# EAGLE design CC2533_PCB_Biphasic (EAGLE 6.4)
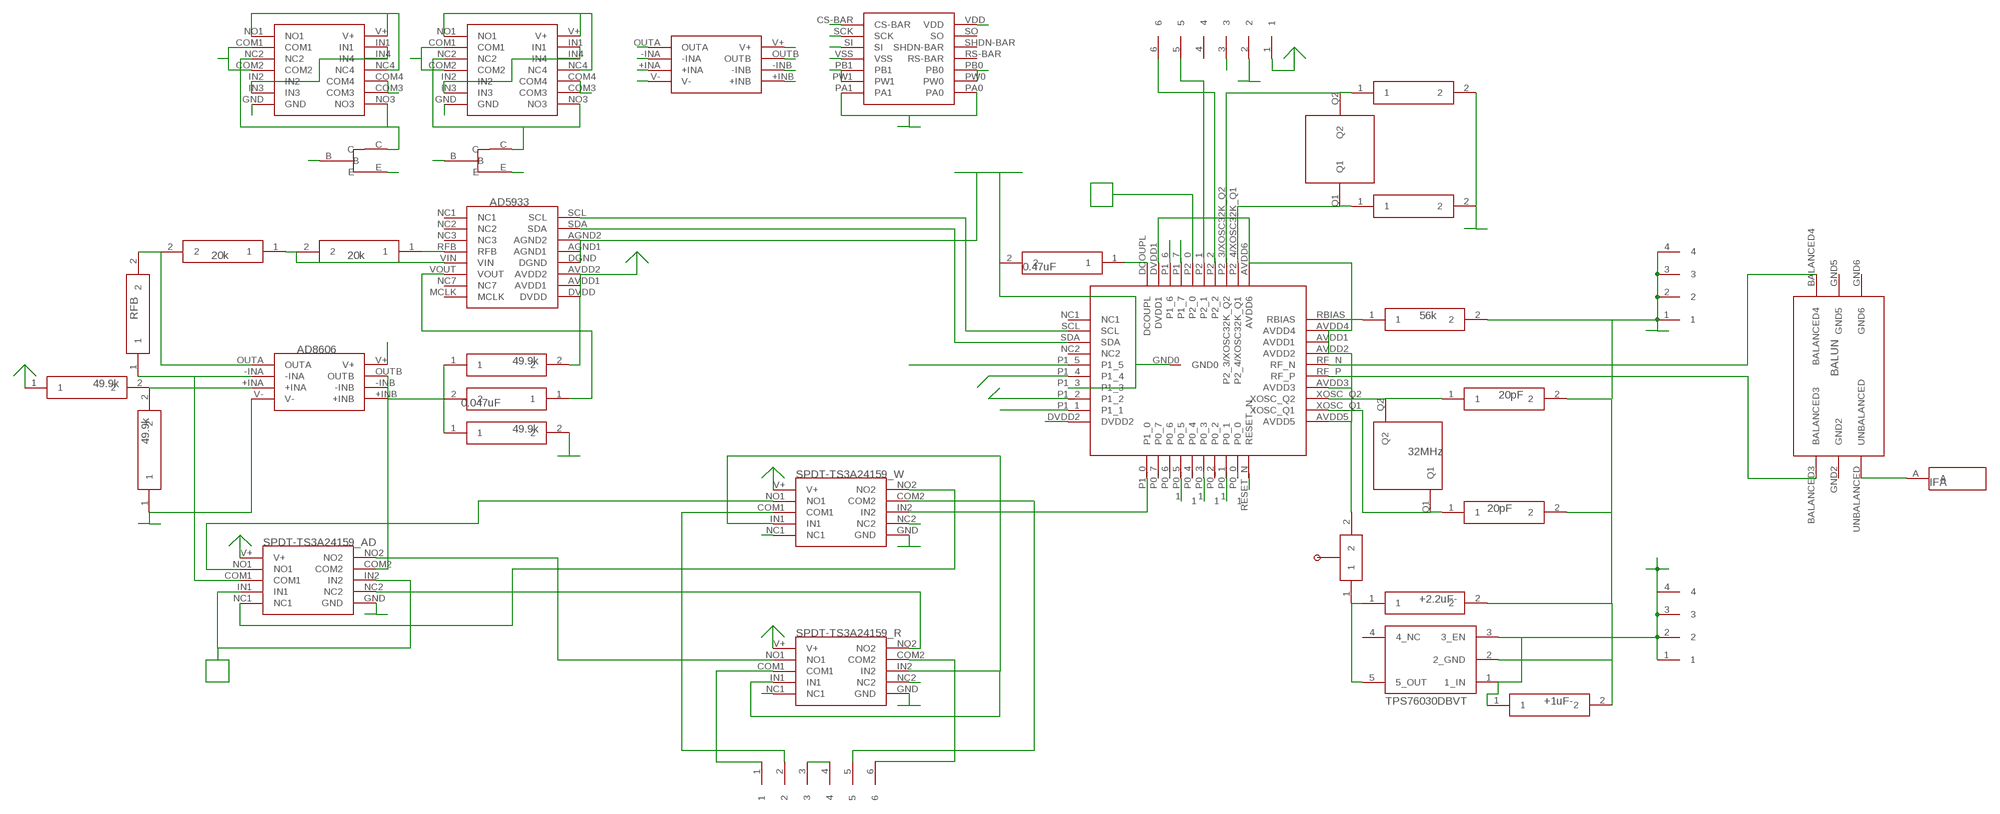
[diagram p0: schematic, sheet 1]

## Parts
U$1  CC2533  [CC2533]
U$2  BALUN  [BALUN]
U$3  X32MHZ  [X32MHZ]
U$4  0201  [0201]
U$5  0201  [0201]
U$6  ANTENNA_BOTTOM  [ANTENNA_BOTTOM]
U$7  FFC4POS  [FFC4POS]
U$8  FFC4POS  [FFC4POS]
U$9  56k  0201  [0201]
U$10  REGULATOR  [REGULATOR]
U$11  0603  [0603]
U$12  0603  [0603]
U$13  SPDT_DUAL  [SPDT_DUAL]
U$14  0201  [0201]
U$15  SPDT_DUAL  [SPDT_DUAL]
U$16  AD5933  [AD5933]
U$17  FFC6POS  [FFC6POS]
U$18  SWITCH_MANUAL  [SWITCH_MANUAL]
U$19  SPDT_DUAL  [SPDT_DUAL]
U$20  AD8606_OPAMP  [AD8606_OPAMP]
U$21  0603_RES  [0603_RES]
U$22  0603_RES  [0603_RES]
U$23  0603_RES  [0603_RES]
U$24  0201  [0201]
U$25  0201  [0201]
U$26  0402_CAP  [0402_CAP]
U$27  0201  [0201]
U$28  0201  [0201]
U$29  DRILL_HOLE  [DRILL_HOLE]
U$30  FFC6POS  [FFC6POS]
U$31  DRILL_HOLE  [DRILL_HOLE]
U$32  AS1753_QUAD_SPST  [AS1753_QUAD_SPST]
U$33  AS1753_QUAD_SPST  [AS1753_QUAD_SPST]
U$34  AD8606_OPAMP  [AD8606_OPAMP]
U$35  MP42100  [MP42100]
U$36  NPN_2SC3707  [NPN_2SC3707]
U$37  NPN_2SC3707  [NPN_2SC3707]
U$38  DRILL_HOLE  [DRILL_HOLE]
U$39  X32.768KHZ  [X32.768KHZ]
U$40  0201  [0201]
U$41  0201  [0201]

## Nets
B1: U$34.OUTA U$36.B
B2: U$34.OUTB U$37.B
C1: U$32.NC2 U$32.NO3 U$36.C
C2: U$33.NC2 U$33.NO3 U$37.C
CLK: U$1.P1_5 U$35.SCK
CS: U$1.P1_1 U$35.CS-BAR
E1: U$34.-INA U$35.PB1 U$35.PW1 U$36.E
E2: U$34.-INB U$35.PB0 U$35.PW0 U$37.E
GND: U$1.GND0 U$1.P1_3 U$4.2 U$5.2 U$8.1 U$8.2 U$8.3 U$8.4 U$9.2 U$10.2(2_GND) U$11.2 U$12.2 U$13.GND U$14.2 U$15.GND U$16.AGND1 U$16.AGND2 U$16.DGND U$17.2 U$19.GND U$20.V- U$25.1 U$28.2 U$30.3 U$30.4 U$32.GND U$33.GND U$34.V- U$35.PA0 U$35.PA1 U$35.VSS U$40.2 U$41.2
I_LEFT: U$15.NC1 U$33.COM1 U$33.COM2
I_LEFT_REF: U$13.NC1 U$33.COM3 U$33.COM4
I_RIGHT: U$15.NC2 U$32.COM1 U$32.COM2
I_RIGHT_REF: U$13.NC2 U$32.COM3 U$32.COM4
IN_5933: U$1.P2_0 U$19.IN1 U$19.IN2
IN_W: U$1.P1_0 U$13.IN1 U$13.IN2 U$15.IN1 U$15.IN2
LEFT: U$1.P1_4 U$34.+INB
MISO: U$1.P1_7 U$32.IN1 U$32.IN2 U$32.IN3 U$32.IN4 U$33.IN1 U$33.IN2 U$33.IN3 U$33.IN4
MOSI: U$1.P1_6 U$35.SI
N$1: U$1.RF_N U$2.BALANCED4
N$2: U$1.RF_P U$2.BALANCED3
N$3: U$2.UNBALANCED U$6.A
N$4: U$1.XOSC_Q2 U$3.Q2 U$5.1
N$5: U$1.XOSC_Q1 U$3.Q1 U$4.1
N$6: U$16.RFB U$21.1
N$7: U$15.NO1 U$19.NO1
N$8: U$15.NO2 U$19.NC1
N$9: U$13.NO1 U$19.NO2
N$10: U$13.NO2 U$19.NC2
N$11: U$19.COM1 U$20.-INA U$23.1
N$12: U$1.RBIAS U$9.1
N$13: U$1.SCL U$16.SCL
N$14: U$1.SDA U$16.SDA
N$15: U$15.COM1 U$30.2
N$16: U$1.P2_4/XOSC32K_Q1 U$39.Q1 U$41.1
N$17: U$1.P2_1 U$17.5
N$18: U$1.DCOUPL U$14.1
N$19: U$16.VOUT U$26.1
N$20: U$1.P2_2 U$17.6
N$21: U$10.5(5_OUT) U$11.1 U$18.1
N$22: U$1.P2_3/XOSC32K_Q2 U$39.Q2 U$40.1
N$23: U$16.VIN U$21.2 U$22.1
N$24: U$1.P0_5 U$29.1
N$25: U$20.OUTA U$22.2 U$23.2
N$27: U$20.+INA U$24.2 U$25.2
N$28: U$20.+INB U$26.2 U$27.1 U$28.1
N$29: U$19.COM2 U$20.-INB U$20.OUTB
N$30: U$15.COM2 U$30.5
N$32: U$13.COM2 U$30.6
N$35: U$13.COM1 U$30.1
P0_1: U$1.P0_1 U$38.1
P0_3: U$1.P0_3 U$31.1
RESET: U$1.RESET_N U$17.3
RIGHT: U$1.P1_2 U$34.+INA
V+: U$7.1 U$7.2 U$7.3 U$7.4 U$10.1(1_IN) U$10.3(3_EN) U$12.1
VDD: U$1.AVDD1 U$1.AVDD2 U$1.AVDD3 U$1.AVDD4 U$1.AVDD5 U$1.AVDD6 U$1.DVDD1 U$1.DVDD2 U$13.V+ U$15.V+ U$16.AVDD1 U$16.AVDD2 U$16.DVDD U$17.1 U$18.2 U$19.V+ U$20.V+ U$24.1 U$27.2 U$32.NC4 U$32.NO1 U$32.V+ U$33.NC4 U$33.NO1 U$33.V+ U$34.V+ U$35.VDD
Unconnected: U$1.P0_0 U$1.P0_2 U$1.P0_4 U$1.P0_6 U$1.P0_7 U$10.4(4_NC) U$16.MCLK U$16.NC1 U$16.NC2 U$16.NC3 U$16.NC7 U$17.4 U$35.RS-BAR U$35.SHDN-BAR U$35.SO

## Power pins joined to a net without a drawn wire
GND2: U$2.GND2
GND5: U$2.GND5
GND6: U$2.GND6
NC1: U$1.NC1
NC2: U$1.NC2

## Library data of the parts
U$1 = CC2530_PCB_TL:CC2533
U$2 = CC2530_PCB_TL:BALUN: 2.45 GHz Impedance Matched Balun-BPF: For TI CC253X, CC254X, CC257X, CC853X and CC852X Chipset family P/N 2450BM15A0002
U$3 = CC2530_PCB_TL:X32MHZ: X32MHz ABM12-32.000MHZ-B2X-T3; X: 32MHz
U$4 U$5 = CC2530_PCB_TL:0201: Package / Case 0201 (0603 Metric); CAP: 20pF
U$6 = CC2530_PCB_TL:ANTENNA_BOTTOM: Antenna for use in bottom layer of CC2530 PCB
U$7 U$8 = CC2530_PCB_TL:FFC4POS: FFC COnnector 4POS
U$9 = CC2530_PCB_TL:0201: Package / Case 0201 (0603 Metric); R_BIAS: 56k
U$10 = CC2530_PCB_TL:REGULATOR: IC REG LDO 3V 50MA SOT23-5 TPS76030DBVT
U$11 = CC2530_PCB_TL:0603: Package / Case 0603 (1608 Metric); CAP: +2.2uF-
U$12 = CC2530_PCB_TL:0603: Package / Case 0603 (1608 Metric); CAP: +1uF-
U$13 U$15 U$19 = CC2530_PCB_TL:SPDT_DUAL: TS3A24159DGSR IC SWITCH DUAL SPDT 10MSOP
U$14 = CC2530_PCB_TL:0201: Package / Case 0201 (0603 Metric); CAP: 0.47uF
U$16 = CC2530_PCB_TL:AD5933: AD5933
U$17 U$30 = CC2530_PCB_TL:FFC6POS: FFC Connector 6POS
U$18 = CC2530_PCB_TL:SWITCH_MANUAL
U$20 U$34 = CC2530_PCB_TL:AD8606_OPAMP: OPAMP AD8606ARMZ-REEL
U$21 U$22 = CC2530_PCB_TL:0603_RES; RES: 20k
U$23 = CC2530_PCB_TL:0603_RES
U$24 U$25 U$27 U$28 = CC2530_PCB_TL:0201: Package / Case 0201 (0603 Metric); RES: 49.9k
U$26 = CC2530_PCB_TL:0402_CAP; CAP: 0.047uF
U$29 U$31 U$38 = CC2530_PCB_TL:DRILL_HOLE
U$32 U$33 = CC2530_PCB_TL:AS1753_QUAD_SPST: QUAD SPST SWITCH AS1753S
U$35 = CC2530_PCB_TL:MP42100: Digital Potentiometer 100K 2CH SPI 14-SOIC MCP42100-I/SL-ND
U$36 U$37 = CC2530_PCB_TL:NPN_2SC3707: NPN Transistor 2SC370700L
U$39 = CC2530_PCB_TL:X32.768KHZ: X32.768kHz 9HT11-32.768KDZC-T
U$40 U$41 = CC2530_PCB_TL:0201: Package / Case 0201 (0603 Metric)

## Board
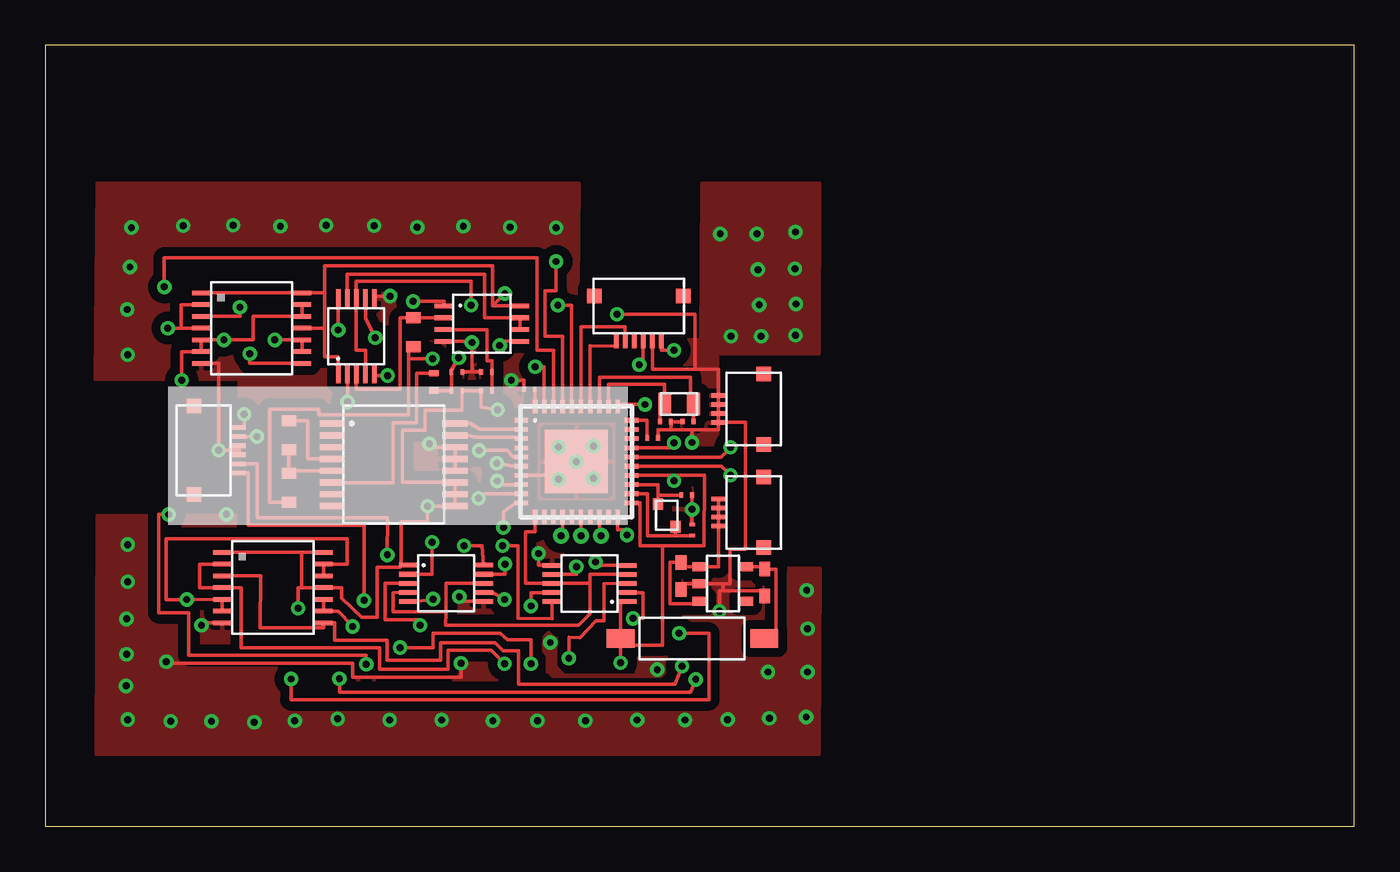
[diagram p1: board, top side]
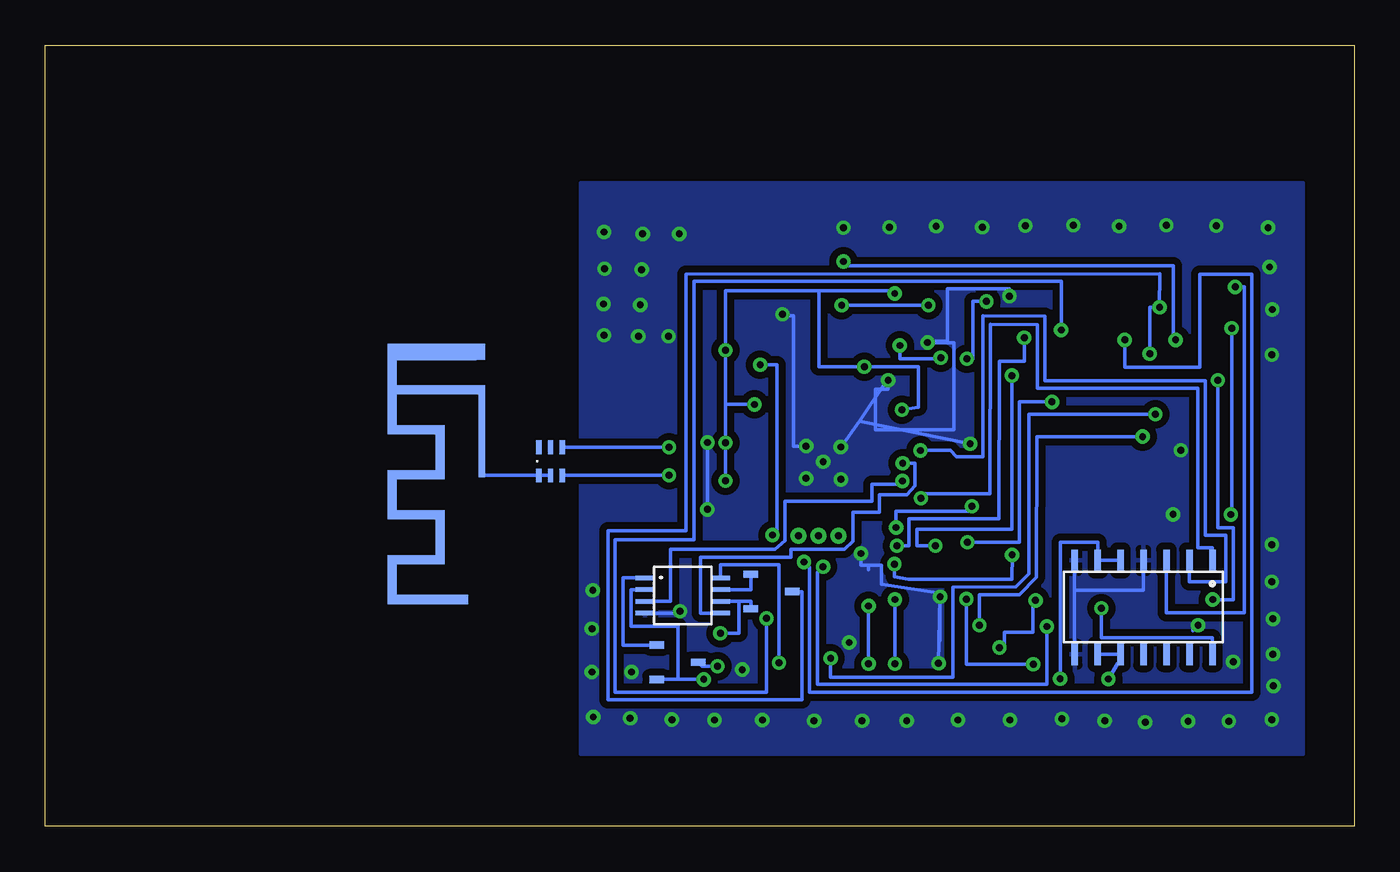
[diagram p2: board, bottom side, seen from below]

Size 72.39 x 43.18 mm. Coordinates in mm from the lower left corner, seen from the top.
Outline: 0,0 72.39,0 72.39,43.18 0,43.18 0,0
Copper layers (1*16): Top 0.035mm / dielectric 1.5mm / Bottom 0.035mm
Design rules "default *": minimum track width 8mil, minimum drill 15mil, track to track 6mil, track to pad 6mil, pad to pad 6mil, via to via 6mil, smd to smd 6mil, copper to edge 40mil, drill to drill 8mil, minimum pad ring 10mil, minimum via ring 8mil, stop-mask expansion 4mil, vias tented up to drill 0mil, thermal gap 10mil

### Footprints (pad centres in the part's own frame; a part is rotated, then mirrored left to right if it is on the bottom)
CC2533 = smd 0.762 x 0.254: AVDD1 3.048,1.27; AVDD2 3.048,0.762; AVDD3 3.048,-0.762; AVDD4 3.048,1.778; AVDD5 3.048,-2.286; DVDD2 -3.048,-2.286; NC1 -3.048,2.286; NC2 -3.048,0.762; P1_1 -3.048,-1.778; P1_2 -3.048,-1.27; P1_3 -3.048,-0.762; P1_4 -3.048,-0.254; P1_5 -3.048,0.254; RBIAS 3.048,2.286; RF_N 3.048,0.254; RF_P 3.048,-0.254; SCL -3.048,1.778; SDA -3.048,1.27; XOSC_Q1 3.048,-1.778; XOSC_Q2 3.048,-1.27 | smd 0.254 x 0.762: AVDD6 2.286,3.048; DCOUPL -2.286,3.048; DVDD1 -1.778,3.048; P0_0 1.778,-3.048; P0_1 1.27,-3.048; P0_2 0.762,-3.048; P0_3 0.254,-3.048; P0_4 -0.254,-3.048; P0_5 -0.762,-3.048; P0_6 -1.27,-3.048; P0_7 -1.778,-3.048; P1_0 -2.286,-3.048; P1_6 -1.27,3.048; P1_7 -0.762,3.048; P2_0 -0.254,3.048; P2_1 0.254,3.048; P2_2 0.762,3.048; P2_3/XOSC32K_Q2 1.27,3.048; P2_4/XOSC32K_Q1 1.778,3.048; RESET_N 2.286,-3.048 | smd 3.5 x 3.5: GND0 0,0
BALUN = smd 0.75 x 0.3: BALANCED3 -0.782,-0.655; BALANCED4 0.768,-0.655; GND2 -0.782,-0.005; GND5 0.768,-0.005; GND6 0.768,0.645; UNBALANCED -0.782,0.645
X32MHZ = smd 0.55 x 0.65: Q1 0.496,-0.576; Q2 -0.454,0.674
0201 = smd 0.203 x 0.3: 1 -0.3,-0.001; 2 0.3,-0.001
ANTENNA_BOTTOM = smd 0.203 x 0.203 bottom: A -0.014,-0.096 | smd 0.381 x 4.589 bottom: A1 -0.014,2.097 | smd 0.5 x 0.9 bottom: P$3 0.059,6.728 | smd 4.4 x 0.9 bottom: P$4 2.509,6.727 | smd 0.5 x 5 bottom: P$5 4.945,4.677 | smd 2.65 x 0.5 bottom: P$6 3.37,2.426; P$12 3.375,-2.271; P$14 3.372,-4.76 | smd 0.5 x 2 bottom: P$7 2.296,1.179; P$13 2.299,-3.512 | smd 4.4 x 0.5 bottom: P$8 2.495,4.627 | smd 0.5 x 2.7 bottom: P$9 4.948,-1.171; P$15 4.945,-5.861 | smd 3.94 x 0.5 bottom: P$10 2.725,-6.962 | smd 2.667 x 0.5 bottom: P$11 3.381,-0.071 | smd 0.5 x 0.5 bottom: P$16 0.045,4.627
FFC4POS = smd 0.762 x 0.254: 1 0.04,0.742; 2 0.04,0.242; 3 0.04,-0.258; 4 0.04,-0.758 | smd 0.8 x 0.8: P$5 -2.46,1.94; P$6 -2.46,-1.96
REGULATOR = smd 0.5 x 0.8: 1 0.94,1.275; 2 0,1.275; 3 -0.95,1.275; 4 -0.95,-1.275; 5 0.95,-1.275
0603 = smd 0.8 x 0.6: 1 -0.751,0; 2 0.749,0
SPDT_DUAL = smd 1.05 x 0.25: COM1 -2.075,0; COM2 2.075,0.5; GND 2.075,-1; IN1 -2.075,-0.5; IN2 2.075,0; NC1 -2.075,-1; NC2 2.075,-0.5; NO1 -2.075,0.5; NO2 2.075,1; V+ -2.075,1
AD5933 = smd 1.4 x 0.35: AGND1 3.45,0.25; AGND2 3.45,0.9; AVDD1 3.45,-1.7; AVDD2 3.45,-1.05; DGND 3.45,-0.4; DVDD 3.45,-2.35; MCLK -3.35,-2.35; NC1 -3.35,2.2; NC2 -3.35,1.55; NC3 -3.35,0.9; NC7 -3.35,-1.7; RFB -3.35,0.25; SCL 3.45,2.2; SDA 3.45,1.55; VIN -3.35,-0.4; VOUT -3.35,-1.05
FFC6POS = smd 0.762 x 0.254: 1 0.008,1.269; 2 0.008,0.769; 3 0.008,0.269; 4 0.008,-0.231; 5 0.008,-0.731; 6 0.008,-1.231 | smd 0.8 x 0.8: P$7 -2.49,2.47; P$8 -2.49,-2.43
SWITCH_MANUAL = smd 1.524 x 1.016: 1 -4.13,0; 2 3.81,0
AD8606_OPAMP = smd 1 x 0.25: +INA -2.1,-0.325; +INB 2.1,-0.975; -INA -2.1,0.325; -INB 2.1,-0.325; OUTA -2.1,0.975; OUTB 2.1,0.325; V+ 2.1,0.975; V- -2.1,-0.975
0603_RES = smd 0.6 x 0.8: 1 -0.8,0; 2 0.8,0
0402_CAP = smd 0.33 x 0.533: 1 -0.475,0.001; 2 0.501,0.001
DRILL_HOLE = drill 0.381 pad 0.635: 1 0,0
AS1753_QUAD_SPST = smd 1 x 0.25: COM1 -2.8,1.3; COM2 -2.8,0; COM3 2.8,-1.3; COM4 2.8,-0.65; GND -2.8,-1.95; IN1 2.8,1.3; IN2 -2.8,-0.65; IN3 -2.8,-1.3; IN4 2.8,0.65; NC2 -2.8,0.65; NC4 2.8,0; NO1 -2.8,1.95; NO3 2.8,-1.95; V+ 2.8,1.95
MP42100 = smd 1.2 x 0.36: CS-BAR -2.595,3.81; PA0 2.595,-3.81; PA1 -2.595,-3.81; PB0 2.595,-1.27; PB1 -2.595,-1.27; PW0 2.595,-2.54; PW1 -2.595,-2.54; RS-BAR 2.595,0; SCK -2.595,2.54; SHDN-BAR 2.595,1.27; SI -2.595,1.27; SO 2.595,2.54; VDD 2.595,3.81; VSS -2.595,0
NPN_2SC3707 = smd 0.4 x 0.8: B -0.95,-1.15; C 0,1.15; E 0.95,-1.15
X32.768KHZ = smd 1.25 x 0.7: Q1 0.009,-0.811; Q2 0.009,0.789

### Placement (x,y rotation side)
U$1  29.37,20.16 0 top
U$2  44.45,20.19 90 bottom
U$3  34.35,17.14 0 top
U$4  35.77,16.38 90 top
U$5  35.47,18.31 0 top
U$6  48.26,19.5 0 top
U$7  37.27,17.34 180 top
U$8  37.27,23.06 180 top
U$9  33.59,21.46 0 top
U$10  37.48,13.41 90 top
U$11  39.79,13.48 270 top
U$12  35.16,13.84 270 top
U$13  30.1,13.43 180 top
U$14  26.78,24.16 180 top
U$15  22.16,13.44 0 top
U$16  19.21,20.06 0 top
U$17  32.8,26.82 270 top
U$18  35.63,10.39 180 top
U$19  17.2,27.1 90 top
U$20  24.15,27.79 0 top
U$21  13.47,21.61 270 top
U$22  13.47,18.72 270 top
U$23  20.36,27.32 270 top
U$24  24.4,24.08 0 top
U$25  24.4,25.12 0 top
U$26  21.5,24.57 270 top
U$27  22.76,24.08 0 top
U$28  22.76,25.12 0 top
U$29  28.52,16.07 0 top
U$30  10.71,20.77 0 top
U$31  29.63,16.07 0 top
U$32  12.59,13.2 0 top
U$33  11.41,27.54 0 top
U$34  37.13,12.76 0 bottom
U$35  11.65,12.11 270 bottom
U$36  37.42,9.07 270 bottom
U$37  32.22,12.98 270 bottom
U$38  30.74,16.07 0 top
U$39  35.06,23.36 270 top
U$40  35.54,22.37 180 top
U$41  34.3,22.37 0 top

### Tracks (layer width: path | path; a pad name or v marks a point on that pad's centre or on a via)
B1
  Bottom 0.203: U$36.B 40.43,10.02 40.43,13.74 U$34.OUTA | U$34.OUTA
B2
  Bottom 0.203: U$34.OUTB 33.37,13.09 U$37.B
C1  (via drill 0.38 pad 0.64)
  Top 0.203: v35.22,8.86 34.81,7.86 26.17,7.86 26.17,9.71 25.31,9.71 24.87,10.16 21.85,10.16 21.85,9.17 18.92,9.17 18.92,10.3 16.01,10.3 16.01,11.25 U$32.NO3 15.38,10.99 11.9,10.99 11.91,13.85 U$32.NC2
  Bottom 0.203: U$36.C 36.06,8.86 v35.22,8.86
C2  (via drill 0.38 pad 0.64)
  Top 0.203: U$33.NC2 10.77,28.19 v10.77,28.7 | U$33.NO3 11.3,25.59 v11.31,26.12
  Bottom 0.203: v11.31,26.12 11.31,28.7 v10.77,28.7 10.77,30.55 36.96,30.53 36.96,16.34 41.26,16.34 41.27,16.15 41.27,7.01 30.56,7.01 30.56,12.98 U$37.C | U$37.C
CLK  (via drill 0.38 pad 0.64)
  Top 0.203: U$1.P1_5 25.88,20.43 25.53,20.78 v23.99,20.78
  Bottom 0.203: U$35.SCK 9.11,13.51 7.11,13.51 7.11,16.1 8.23,16.1 8.25,24.64 17.11,24.64 17.1,28.21 20.53,28.21 20.53,20.43 21.99,20.43 22.34,20.78 v23.99,20.78
CS  (via drill 0.38 pad 0.64)
  Top 0.203: v23.97,18.13 24.23,18.39 24.24,18.39 U$1.P1_1
  Bottom 0.203: U$35.CS-BAR 7.84,15.41 8.66,15.41 8.66,15.45 8.65,24.21 17.52,24.21 17.53,27.74 20.13,27.75 20.15,18.39 23.68,18.39 23.71,18.39 v23.97,18.13
E1  (via drill 0.38 pad 0.64)
  Top 0.203: v35.98,8.12 35.69,7.42 16.27,7.42 v16.27,8.15
  Bottom 0.203: U$35.PB1 U$35.PW1 14.19,15.71 16.27,15.71 v16.27,8.15 | U$34.-INA 40.01,13.09 40.01,11.05 37.4,11.05 37.4,8.12 | 37.4,8.12 U$36.E | v35.98,8.12 37.4,8.12 | U$36.E
E2  (via drill 0.38 pad 0.64)
  Top 0.203: v13.59,8.14 13.59,7.01 36.7,7.01 36.7,10.67 v35.06,10.67
  Bottom 0.203: U$34.-INB 34.43,12.44 34.02,12.44 | 34.02,12.44 33.37,12.44 U$37.E | U$35.PW0 U$35.PB0 12.92,9.02 13.07,9.02 v13.59,8.14 | v35.06,10.67 34.43,10.67 34.02,10.67 34.02,12.44
GND  (via drill 0.38 pad 0.64)
  Top 0.203: U$4.2 v35.77,17.52 U$5.2 35.77,18.26 | U$9.2 33.89,21.91 34.6,21.91 | U$40.2 34.7,22.37 U$41.2 34.6,21.91 | U$8.1 U$8.2 U$8.3 U$8.4 37.23,25.25 35.95,25.25 | U$8.1 37.23,21.91 35.77,21.91 | 35.77,21.91 34.6,21.91 | U$12.2 35.29,13.41 U$10.2 | U$11.2 39.79,13.03 37.48,13.03 | 37.48,13.03 37.48,13.41 U$10.2 | U$16.AGND1 U$16.AGND2 21.44,20.96 v21.25,21.15 | U$16.AGND1 U$16.DGND | 23.11,20.32 U$16.AGND1 | U$17.2 33.57,25.25 35.95,25.25 | U$14.2 26.48,24.66 v25.78,24.66 | U$30.4 U$30.3 10.72,20.79 v9.59,20.8 9.59,25.59 U$33.GND | 35.77,21.91 v35.77,21.22 | 22.9,12.44 U$15.GND 22.9,12.44 | 22.9,12.44 v22.9,12.69 | U$10.2 37.86,13.41 37.86,15.31 38.73,15.31 38.73,22.33 U$8.1 | U$1.GND0 30.15,20.16 | 30.15,20.16 30.15,21.21 | 30.58,19.03 30.58,19.01 30.41,19.17 30.41,20.16 30.15,20.16 | 27.78,19.03 27.78,19.4 | 27.78,19.4 U$1.P1_3 | 27.78,19.4 29.37,19.4 U$1.GND0 | U$1.GND0 28.39,20.16 v28.39,20.96 v28.4,20.96 | v28.4,20.96 28.43,20.96 | 28.43,20.96 30.41,20.96 30.41,21.21 30.04,21.19 30.5,21.37 30.5,21.21 30.31,21.21 v30.31,21.02 | 28.43,20.96 28.43,20.97 v28.4,20.97 v28.4,20.96 | U$13.GND 27.27,14.43 v27.28,15.08 | v19.07,29.31 18.2,29.31 U$19.GND | U$20.V- 23.6,26.82 v23.6,26.75 23.61,26.75 23.61,25.12 | U$32.GND 8.71,11.25 v8.64,11.12 | v22.99,9.02 22.99,8.25 17,8.25 17,9.02 6.7,9.02 v6.7,9.1 | v37.28,11.9 37.28,13.03 37.48,13.03 | v31.62,28.31 35.94,28.31 35.95,25.25 | U$28.2 23.61,25.12 | 23.61,25.12 U$25.1
  Bottom 0.203: v35.77,21.22 35.77,17.59 v35.77,17.52 | v22.9,12.69 22.9,12.9 26.15,13.39 26.16,14.43 26.87,14.43 | 27.37,22.39 25.86,24.66 v25.78,24.66 25.78,24.16 U$14.2 26.48,21.91 22.15,21.91 22.15,26.75 v23.6,26.75 23.52,26.82 22.5,26.82 22.49,29.72 19.07,29.72 v19.07,29.31 | v21.25,21.15 27.37,22.39 | 27.37,22.39 v28.4,20.96 v28.4,20.97 | 22.91,10.27 v22.9,12.69 | v22.9,12.69 | U$35.VSS 11.65,13.04 15.47,13.04 | 15.47,13.04 U$35.PA1 | U$35.PA0 15.47,13.04 | v8.64,11.12 8.91,11.04 8.91,10.82 | v22.9,12.69 v22.99,9.02 | v6.7,9.1 6.67,9.1 | 26.87,14.18 26.87,14.43 27.27,14.43 v27.28,15.08 | U$34.V- 37.28,11.79 v37.28,11.9 | v30.31,21.02 31.01,21.02 31.01,28.22 31.62,28.22 v31.62,28.31
  other vias: 29.37,20.16 30.31,19.24 28.39,19.18 27.93,10.17 33.84,8.67 37.93,27.09 39.59,27.09 41.48,27.14 41.51,28.88 41.46,30.83 39.49,28.83 39.41,30.78 39.35,32.75 37.33,32.75 41.48,32.85 28.25,33.09 25.7,33.12 23.12,33.17 20.57,33.12 18.18,33.2 15.53,33.23 13,33.18 10.4,33.23 7.64,33.2 4.56,26.07 4.53,28.57 4.69,30.92 4.77,33.1 4.56,15.58 4.56,13.52 4.5,11.47 4.5,9.51 42.11,13.05 42.16,10.93 42.16,8.53 39.97,8.53 40.04,5.98 42.08,6.05 37.74,5.9 35.38,5.88 32.74,5.88 29.87,5.84 27.22,5.84 24.75,5.84 21.92,5.88 19.04,5.88 16.17,5.94 13.8,5.84 11.56,5.75 9.19,5.8 6.93,5.8 4.56,5.9 4.47,7.76 10.02,17.24
  pour Top: 27.88,10.68 28.21,10.35 28.21,8.84 28.7,8.36 33.11,8.36 33.83,9.08 34.14,9.08 34.21,9.01 34.21,8.45 34.06,8.3 28.06,8.3 27.77,8.59 27.77,9.72 27.63,9.86 27.63,10.54 27.79,10.7 27.85,10.7
  pour Bottom (isolate 0.381): 2.81,35.58 42.79,35.59 42.79,3.99 2.81,3.98
  pour Top (isolate 0.508): 10.72,17.23 10.72,24.72 2.78,24.72 2.87,35.55 29.52,35.55 29.43,26.9 36.28,26.9 36.32,35.54 42.82,35.59 42.77,26.13 37.17,26.09 37.17,14.32 42.83,14.27 42.79,3.97 2.82,3.97 2.87,17.18
I_LEFT  (via drill 0.38 pad 0.64)
  Top 0.203: U$33.COM1 7.51,28.84 7.51,27.54 | v21.45,12.56 20.61,12.43 20.61,12.44 U$15.NC1 | U$33.COM2 7.51,27.54 | 7.51,27.54 v6.78,27.54 | v6.83,17.24 6.28,17.24 6.28,11.82 7.93,11.82 7.93,9.46 17.75,9.46 v17.75,8.97
  Bottom 0.203: v17.75,8.97 21.44,8.97 v21.45,12.56 | v6.78,27.54 6.78,17.4 v6.83,17.24
I_LEFT_REF  (via drill 0.38 pad 0.64)
  Top 0.203: U$33.COM3 U$33.COM4 v12.7,26.89 | U$13.NC1 30.43,14.43 v30.43,14.62
  Bottom 0.203: v30.43,14.62 30.14,14.31 30.14,7.42 5.66,7.42 5.66,30.53 8.55,30.53 8.55,25.38 9.12,25.38 12.69,25.38 v12.7,26.89
I_RIGHT  (via drill 0.38 pad 0.64)
  Top 0.203: U$32.COM2 | U$32.COM1 8.55,14.5 8.55,13.2 U$32.COM2 | v25.4,8.98 24.67,9.75 22.27,9.75 22.27,8.7 18.5,8.69 18.5,9.88 10.84,9.88 10.85,13.2 U$32.COM2 | v25.4,12.54 24.72,12.94 24.72,12.93 U$15.NC2 | U$32.COM2
  Bottom 0.203: v25.4,8.98 v25.4,12.54
I_RIGHT_REF  (via drill 0.38 pad 0.64)
  Top 0.203: U$32.COM4 U$32.COM3 16.21,11.9 v17,11.05 | U$13.NC2 29.37,13.93 v29.37,14.35
  Bottom 0.203: v29.37,14.35 29.68,14.04 29.68,7.85 17,7.85 v17,11.05
IN_5933  (via drill 0.38 pad 0.64)
  Top 0.203: U$19.IN1 17.71,25.32 17.71,26.33 17.2,26.33 U$19.IN2 17.2,30.12 23.54,30.12 v23.54,28.8 | U$1.P2_0 29.12,28.8 v28.35,28.8
  Bottom 0.203: v28.35,28.8 v23.54,28.8
IN_W
  Top 0.203: 30.14,13.43 30.14,11.74 29.49,11.11 22.15,11.11 22.16,11.83 | 30.14,13.43 30.14,13.93 | U$15.IN2 22.16,13.44 22.16,11.83 | U$15.IN1 19.23,12.93 19.23,11.85 22.16,11.85 22.16,11.83 | U$13.IN1 30.14,13.93 | 30.14,13.93 | 30.14,13.43 U$13.IN2 26.55,13.43 26.55,16.3 27.09,16.3 U$1.P1_0
LEFT  (via drill 0.38 pad 0.64)
  Top 0.203: U$1.P1_4 25.92,19.9 v24.97,20.07
  Bottom 0.203: v24.97,20.07 24.29,20.08 24.29,18.82 24.74,18.33 26.26,18.33 26.26,17.37 27.72,17.37 27.72,15.77 28.18,15.31 31.14,15.31 31.14,14.88 31.62,14.88 36.14,14.88 36.14,11.79 U$34.+INB | U$34.+INB
MISO  (via drill 0.38 pad 0.64)
  Top 0.203: U$33.IN3 U$33.IN2 | U$33.IN4 U$33.IN1 | U$32.IN3 U$32.IN2 v7.83,12.54 6.68,12.54 6.68,15.89 16.71,15.89 16.71,14.5 U$32.IN1 U$32.IN4 | U$33.IN3 | U$33.IN2 | U$33.IN2 v9.88,26.89 11.51,26.89 11.51,28.19 U$33.IN4 | U$33.IN4 | v7.54,24.66 7.54,26.24 U$33.IN3 | U$1.P1_7 28.61,27.09 27.65,27.09 27.65,29.62 28.25,29.62 v28.25,31.23
  Bottom 0.203: v7.83,12.54 6.68,12.54 6.68,16.52 7.54,16.52 v7.54,24.66 | v28.25,31.23 28.25,31.04 28.25,31 10.01,31 10.01,26.89 v9.88,26.89
MOSI  (via drill 0.38 pad 0.64)
  Top 0.203: U$1.P1_6 28.1,26.31 27.2,26.31 27.2,31.42 6.59,31.42 v6.59,29.82
  Bottom 0.203: U$35.SI 10.38,11.82 6.07,11.81 6.07,29.82 v6.59,29.82
N$1  (via drill 0.38 pad 0.64)
  Top 0.203: U$1.RF_N 37.36,20.42 v37.9,20.96
  Bottom 0.203: v37.9,20.96 U$2.BALANCED4
N$2  (via drill 0.38 pad 0.64)
  Top 0.203: U$1.RF_P 37.4,19.91 v37.9,19.41
  Bottom 0.203: v37.9,19.41 U$2.BALANCED3
N$3
  Bottom 0.203: U$2.UNBALANCED 44.44,19.41 U$6.A
N$4
  Top 0.203: U$1.XOSC_Q2 33.89,18.89 33.89,18.43 33.9,18.43 U$3.Q2 33.9,18.31 U$5.1
N$5
  Top 0.203: U$1.XOSC_Q1 33.31,18.39 33.31,16.07 34.85,16.07 | U$4.1 34.85,16.07 | U$3.Q1 34.85,16.07
N$6
  Top 0.203: U$16.RFB 14.5,20.31 14.5,22.42 U$21.1
N$7  (via drill 0.38 pad 0.64)
  Top 0.203: U$15.NO1 21.4,13.94 v21.4,15.7 | v16.71,23.46 16.71,25.32 U$19.NO1
  Bottom 0.203: v21.4,15.7 18.52,15.7 18.52,23.46 v16.71,23.46
N$8  (via drill 0.38 pad 0.64)
  Top 0.203: U$15.NO2 24.17,15.51 v23.16,15.51 | v18.93,24.92 18.22,24.92 U$19.NC1
  Bottom 0.203: v23.16,15.51 24.18,15.5 24.18,16.42 18.93,16.42 v18.93,24.92
N$9  (via drill 0.38 pad 0.64)
  Top 0.203: v16.2,27.44 16.21,29.47 U$19.NO2 | U$13.NO1 33.05,12.93 33.05,11.5 v32.5,11.5
  Bottom 0.203: v32.5,11.5 32.5,7.42 40.87,7.42 40.87,15.85 36.52,15.85 36.52,30.12 16.2,30.12 v16.2,27.44
N$10  (via drill 0.38 pad 0.64)
  Top 0.203: v25.29,15.51 26.14,15.51 26.14,11.49 28.04,11.49 U$13.NO2 | v18.25,27.02 17.71,28.09 17.71,29.47 U$19.NC2
  Bottom 0.203: v25.29,15.51 24.62,15.51 24.62,17 19.64,17 19.63,25.71 18.24,25.71 v18.25,27.02
N$11
  Top 0.203: U$20.-INA 20.2,28.11 U$23.1 19.64,28.11 19.64,24.18 17.2,24.18 U$19.COM1
N$12
  Top 0.203: U$1.RBIAS 33.29,22.45 U$9.1
N$13
  Top 0.203: U$1.SCL 26.03,21.94 26.04,21.94 24.03,21.94 23.5,22.27 23.11,22.27 U$16.SCL
N$14
  Top 0.203: U$16.SDA 23.44,21.61 23.84,21.5 26.02,21.5 26.07,21.42 U$1.SDA
N$15  (via drill 0.38 pad 0.64)
  Top 0.203: U$30.2 11.68,21.54 v11.71,21.54 | U$15.COM1 18.8,13.44 18.8,11.43 20.73,11.43 v20.73,11.12
  Bottom 0.203: v11.71,21.54 17.56,21.54 17.57,13.77 18.53,12.8 20.73,12.8 v20.73,11.12
N$16
  Top 0.203: U$41.1 34,23.35 U$39.Q1 34.25,24.43 31.15,24.43 U$1.P2_4/XOSC32K_Q1
N$17
  Top 0.203: U$1.P2_1 29.63,27.61 32.06,27.61 U$17.5
N$18
  Top 0.203: U$14.1 U$1.DCOUPL
N$19
  Top 0.203: U$26.1 20.53,25.05 20.53,22.32 19.23,22.32 19.23,19 16.31,19 U$16.VOUT
N$20
  Top 0.203: U$1.P2_2 30.14,26.56 31.56,26.55 31.57,26.55 U$17.6
N$21
  Top 0.203: U$10.5 39.79,14.36 U$11.1 39.79,14.22 40.42,14.22 40.42,10.41 39.76,10.41 U$18.1
N$22
  Top 0.203: U$40.1 U$39.Q2 | U$1.P2_3/XOSC32K_Q2 30.64,24.84 35.67,24.84 35.67,23.35 U$39.Q2 | U$39.Q2
N$23
  Top 0.203: U$16.VIN 13.47,19.66 U$22.1 U$21.2
N$24
  Top 0.203: U$1.P0_5 28.61,16.07 U$29.1
N$25  (via drill 0.38 pad 0.64)
  Top 0.203: U$22.2 12.42,17.92 12.42,23.06 15.12,23.06 15.12,22.75 20.1,22.75 20.1,26.52 U$23.2 20.11,26.51 20.11,25.85 v21.42,25.85 | U$20.OUTA 22.05,29.02 v20.34,29.02
  Bottom 0.203: v20.34,29.02 21.1,29.02 21.1,25.85 v21.42,25.85
N$27
  Top 0.203: U$20.+INA 24.43,27.46 24.43,25.75 24.7,25.75 U$25.2 U$24.2
N$28  (via drill 0.38 pad 0.64)
  Top 0.203: U$26.2 U$27.1 U$28.1 22.47,25.24 v22.87,25.91 | v25.14,26.58 25.14,26.81 U$20.+INB
  Bottom 0.203: v25.14,26.58 25.14,25.86 22.87,25.86 v22.87,25.91 | v25.14,26.58
N$29
  Top 0.203: U$20.-INB U$20.OUTB 24.29,28.11 24.29,30.53 16.7,30.53 U$19.COM2
N$30  (via drill 0.38 pad 0.64)
  Top 0.203: U$15.COM2 25.43,13.94 v25.43,14.5 | U$30.5 11.73,20.04 11.73,17.05 18.92,17.05 v18.92,15.01
  Bottom 0.203: v18.92,15.01 18.92,13.66 24.66,13.66 | 24.66,13.66 | 24.66,13.66 25.43,13.8 v25.43,14.5
N$32  (via drill 0.38 pad 0.64)
  Top 0.203: U$30.6 11.21,19.54 11.21,16.63 17.63,16.63 v17.63,12.49 | v26.86,12.18 26.86,12.93 U$13.COM2 | v26.86,8.98 26.87,10.32 25.56,10.32 25.16,10.66 21.44,10.66 21.44,9.88 v19.63,9.88
  Bottom 0.203: v26.86,8.98 v26.86,12.18 | v17.63,12.49 17.77,12.49 17.77,10.73 17.78,10.72 19.35,10.72 19.35,9.88 v19.63,9.88
N$35  (via drill 0.38 pad 0.64)
  Top 0.203: v11,22.78 11,22.04 U$30.1 | U$13.COM1 30.89,13.42 30.89,11.37 30.47,11.37 29.58,10.44 28.96,10.44 v28.96,9.29
  Bottom 0.203: v28.96,9.29 28.96,8.26 22.2,8.26 22.2,13.23 18.71,13.23 17.98,13.96 17.98,22.78 v11,22.78
P0_1
  Top 0.203: 30.67,17.11 U$1.P0_1 30.64,16.07 U$38.1
P0_3
  Top 0.203: U$1.P0_3 | U$1.P0_3 U$31.1
RESET  (via drill 0.38 pad 0.64)
  Top 0.203: 33.08,26.81 U$17.3 33.06,26.81 33.06,25.52 v32.85,25.52 | U$1.RESET_N 31.66,16.41 32.18,16.41 v32.18,16.1
  Bottom 0.203: v32.85,25.52 31.93,25.52 31.93,16.41 32.18,16.41 v32.18,16.1
RIGHT  (via drill 0.38 pad 0.64)
  Top 0.203: U$1.P1_2 24.99,18.89 v24.99,19.09
  Bottom 0.203: v24.99,19.09 24.99,18.91 25,18.9 26.67,18.9 26.68,17.97 31.49,17.97 31.49,15.79 32.03,15.31 37.81,15.31 37.81,15.17 | 37.8,15.3 37.81,15.17 | 37.81,15.17 37.82,12.44 U$34.+INA | U$34.+INA
V+
  Top 0.203: U$10.3 36.2,12.31 34.55,12.31 34.55,14.59 U$12.1 35.29,14.35 U$10.1 37.23,14.35 U$7.1 U$7.2 U$7.3 U$7.4
VDD  (via drill 0.38 pad 0.64)
  Top 0.203: U$1.AVDD4 U$1.AVDD1 U$1.AVDD2 34.78,20.93 v34.78,21.2 | U$16.AVDD2 U$16.AVDD1 U$16.DVDD | U$16.AVDD2 U$16.DVDD | U$16.AVDD2 19.76,19.01 19.76,21.89 21,21.89 21,23.01 | U$16.DVDD 22.64,17.7 v21.14,17.7 21.14,16.84 19.67,16.84 19.67,14.44 | v25.34,16.52 25.34,17.4 25.98,17.87 25.98,17.88 U$1.DVDD2 | 21,23.01 23.06,23.01 U$27.2 U$24.1 24.1,23.16 v25.02,23.03 | U$15.V+ 19.67,14.44 | U$19.V+ 16.2,25.95 15.45,25.95 15.45,27.54 | 15.45,27.54 15.45,29.49 | 15.45,29.49 15.45,30.99 24.75,30.99 24.75,28.77 | 24.75,28.77 U$20.V+ | 21,23.01 | 14.17,13.2 U$32.NC4 16.39,13.2 16.39,12.61 17.5,11.57 18.36,11.56 18.36,14.32 18.39,14.32 19.61,14.33 19.67,14.39 19.67,14.44 | 14.17,13.2 14.17,15.15 U$32.V+ U$32.NO1 | 15.45,29.49 U$33.V+ U$33.NO1 | U$33.NC4 15.45,27.54 | U$18.2 31.82,12.43 U$13.V+ | U$1.AVDD5 32.89,17.88 32.89,15.5 34.13,15.5 | 34.13,15.5 34.13,10.02 31.82,10.02 U$18.2 | U$1.AVDD3 34.78,19.4 | 34.78,19.4 36.44,19.4 36.44,15.51 34.13,15.5 | v34.78,19.11 34.78,19.4 | v31.82,9.05 U$18.2 | U$1.AVDD6 31.65,23.32 v33.17,23.32 | U$17.1 34.07,26.32 v34.78,26.32 | U$1.DVDD1 27.59,25.4 v27.1,25.4 | 24.75,28.77 v25.41,29.45 | v13.99,12.05 13.99,13.2 14.17,13.2
  Bottom 0.203: 21.14,17.43 v21.14,17.7 21.14,17.43 25.33,17.43 v25.34,16.52 | v34.78,19.11 v34.78,21.2 34.78,23.32 | U$34.V+ 35.03,14.45 31.82,14.45 v31.82,9.05 | 34.78,23.32 v34.78,26.32 34.78,29.6 29.62,29.6 | v25.02,23.03 24.11,23.16 24.11,25.4 v27.1,25.4 v27.1,25.39 29.62,25.39 29.62,29.6 | v25.41,29.45 25.58,29.6 29.62,29.6 | v33.17,23.32 34.78,23.32 | U$35.VDD 7.84,10.44 14,10.44 v14,12.05 v13.99,12.05